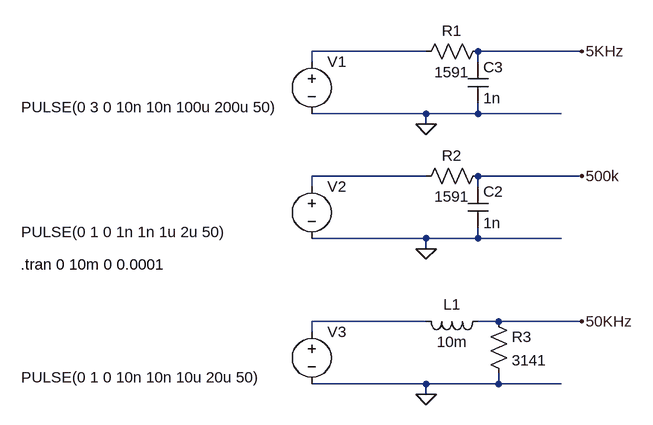
[diagram p0: schematic filtre.asc]
filtre.asc, the LTspice schematic file:
Version 4
SHEET 1 880 680
WIRE 192 80 16 80
WIRE 432 80 272 80
WIRE 16 96 16 80
WIRE 272 96 272 80
WIRE 192 176 16 176
WIRE 272 176 272 160
WIRE 272 176 192 176
WIRE 400 176 272 176
WIRE 192 192 192 176
WIRE 192 272 16 272
WIRE 432 272 272 272
WIRE 16 288 16 272
WIRE 272 288 272 272
WIRE 192 368 16 368
WIRE 272 368 272 352
WIRE 272 368 192 368
WIRE 400 368 272 368
WIRE 192 384 192 368
WIRE 192 496 16 496
WIRE 304 496 272 496
WIRE 432 496 304 496
WIRE 16 512 16 496
WIRE 192 592 16 592
WIRE 304 592 304 576
WIRE 304 592 192 592
WIRE 400 592 304 592
WIRE 192 608 192 592
FLAG 192 384 0
FLAG 432 272 500k
FLAG 192 192 0
FLAG 432 80 5KHz
FLAG 192 608 0
FLAG 432 496 50KHz
SYMBOL voltage 16 80 R0
WINDOW 3 -447 86 Left 2
WINDOW 123 0 0 Left 0
WINDOW 39 0 0 Left 0
SYMATTR Value PULSE(0 3 0 10n 10n 100u 200u 50)
SYMATTR InstName V1
SYMBOL voltage 16 272 R0
WINDOW 3 -447 86 Left 2
WINDOW 123 0 0 Left 0
WINDOW 39 0 0 Left 0
SYMATTR Value PULSE(0 1 0 1n 1n 1u 2u 50)
SYMATTR InstName V2
SYMBOL cap 256 288 R0
SYMATTR InstName C2
SYMATTR Value 1n
SYMBOL res 288 256 R90
WINDOW 0 0 56 VBottom 2
WINDOW 3 32 56 VTop 2
SYMATTR InstName R2
SYMATTR Value 1591
SYMBOL cap 256 96 R0
SYMATTR InstName C3
SYMATTR Value 1n
SYMBOL res 288 64 R90
WINDOW 0 0 56 VBottom 2
WINDOW 3 32 56 VTop 2
SYMATTR InstName R1
SYMATTR Value 1591
SYMBOL voltage 16 496 R0
WINDOW 3 -447 86 Left 2
WINDOW 123 0 0 Left 0
WINDOW 39 0 0 Left 0
SYMATTR Value PULSE(0 1 0 10n 10n 10u 20u 50)
SYMATTR InstName V3
SYMBOL ind 288 480 R90
WINDOW 0 5 56 VBottom 2
WINDOW 3 32 56 VTop 2
SYMATTR InstName L1
SYMATTR Value 10m
SYMBOL res 288 480 R0
SYMATTR InstName R3
SYMATTR Value 3141
TEXT -432 408 Left 2 !.tran 0 10m 0 0.0001

The netlist it stands for:
* filtre.asc
V1 N001 0 PULSE(0 3 0 10n 10n 100u 200u 50)
V2 N002 0 PULSE(0 1 0 1n 1n 1u 2u 50)
C2 500k 0 1n
R2 500k N002 1591
C3 5KHz 0 1n
R1 5KHz N001 1591
V3 N003 0 PULSE(0 1 0 10n 10n 10u 20u 50)
L1 50KHz N003 10m
R3 50KHz 0 3141
.tran 0 10m 0 0.0001
.backanno
.end